# EAGLE schematic Qtouch (EAGLE 5.12)
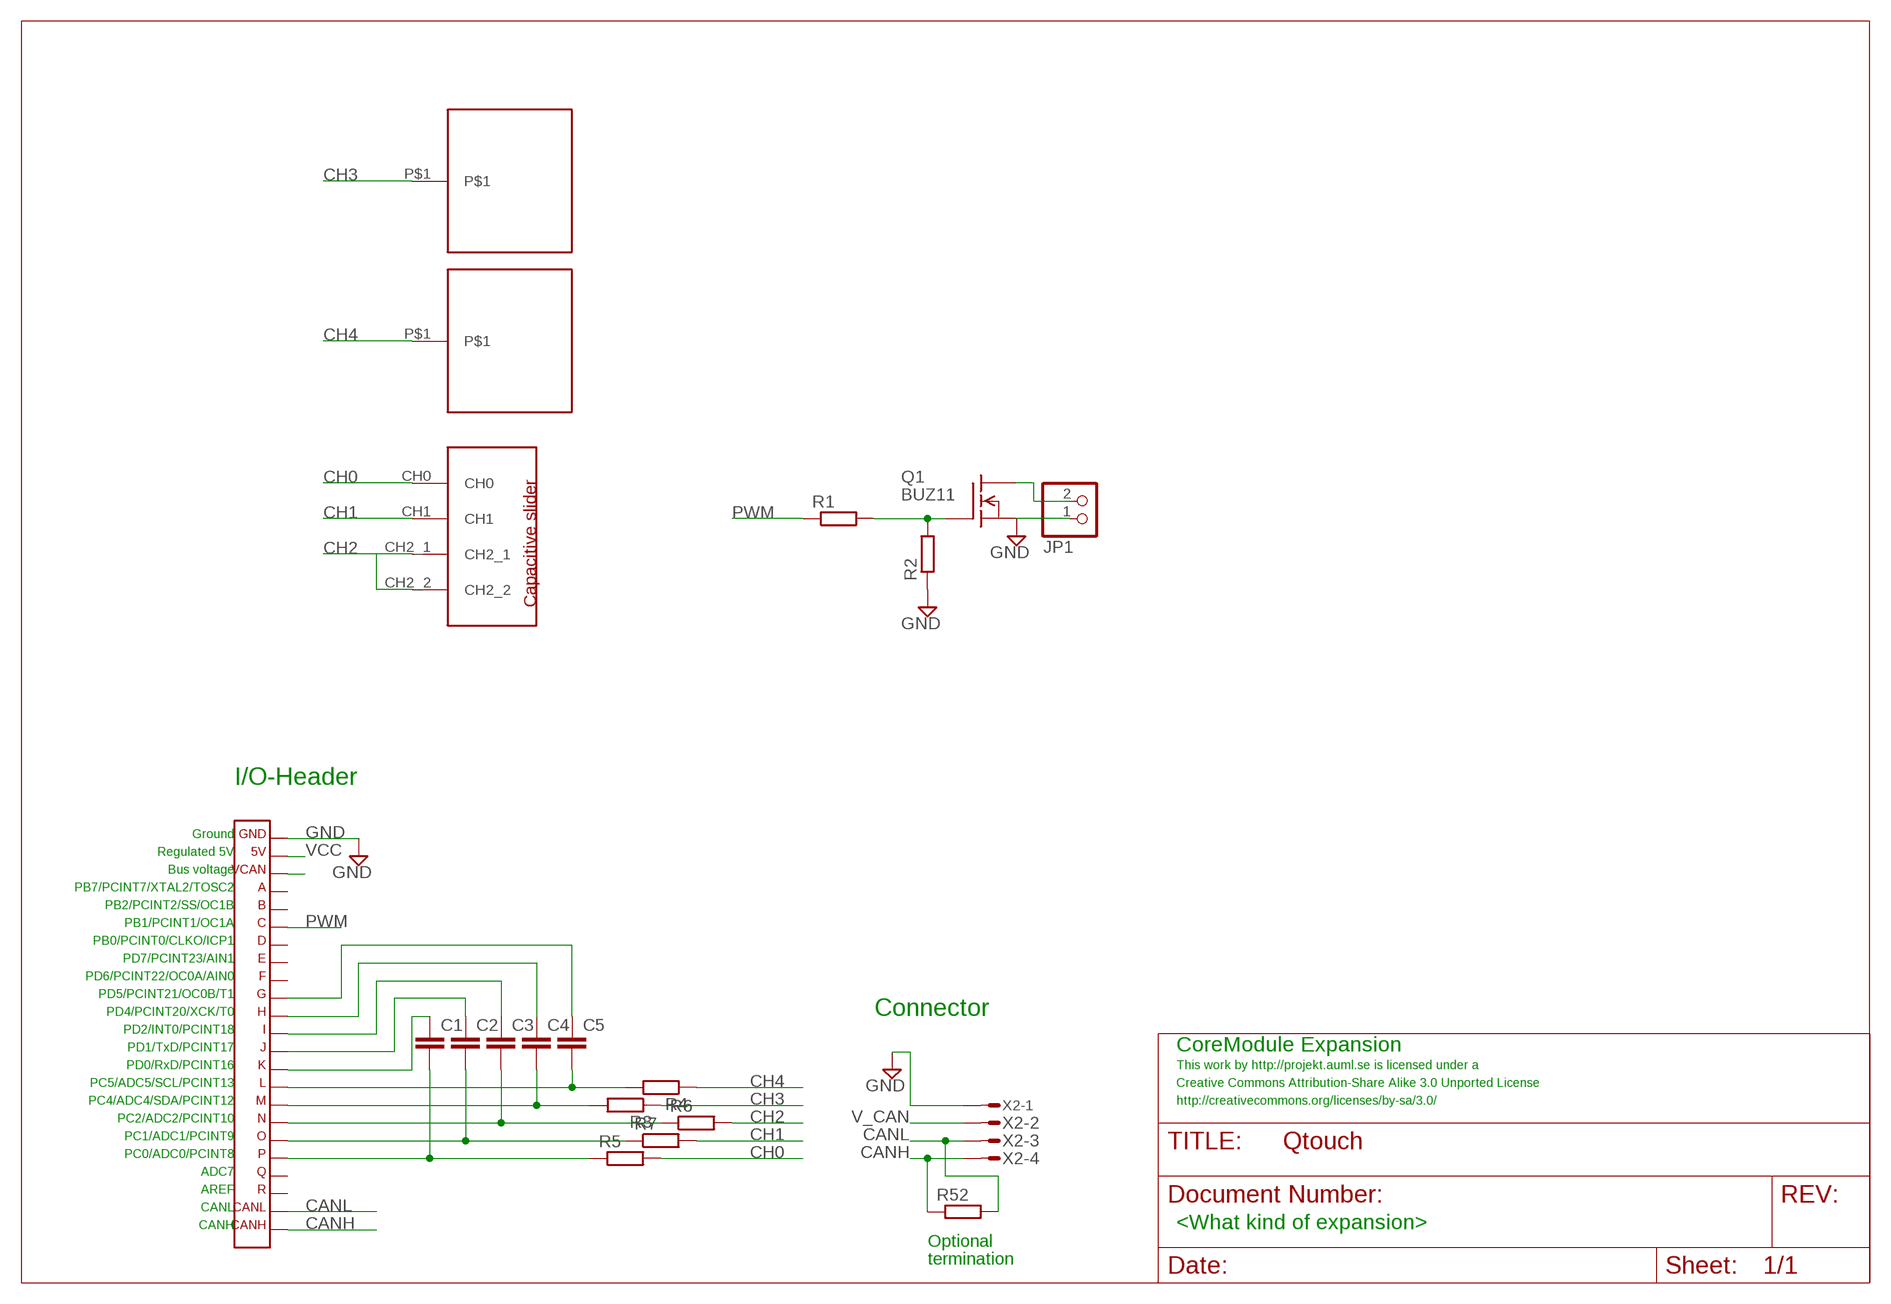
[diagram p0: schematic, sheet 1]

## Parts
C1  C-EUC0603  [C0603]
C2  C-EUC0603  [C0603]
C3  C-EUC0603  [C0603]
C4  C-EUC0603  [C0603]
C5  C-EUC0603  [C0603]
JP1  PINHD-1X2/90  [1X02/90]
Q1  BUZ11  [TO220]
R1  R-EUR0603  [R0603]
R2  R-EUR0603  [R0603]
R3  R-EUR0603  [R0603]
R4  R-EUR0603  [R0603]
R5  R-EUR0603  [R0603]
R6  R-EUR0603  [R0603]
R7  R-EUR0603  [R0603]
R52  R-EUR0603  [R0603]
U$1  SLIDER  [SLIDER_6MM_50MM]
U$2  BUTTON  [BUTTON_12X12MM]
U$3  BUTTON  [BUTTON_12X12MM]
X1  CORETWO_LAYOUTISPHOLES_CU  [CORETWO_LAYOUT_ISPHOLES_CU]
X2  MICROMATCH-4  [MICROMATCH-4]

## Nets
CANH: R52.1 X1.CANH X2.4
CANL: R52.2 X1.CANL X2.3
CH0: R5.2 U$1.CH0
CH1: R7.2 U$1.CH1
CH2: R6.2 U$1.CH2_1 U$1.CH2_2
CH3: R3.1 U$3.P$1
CH4: R4.1 U$2.P$1
EXP_L: C5.2 R4.2 X1.L
EXP_M: C4.2 R3.2 X1.M
EXP_N: C3.2 R6.1 X1.N
EXP_O: C2.2 R7.1 X1.O
EXP_P: C1.2 R5.1 X1.P
GND: JP1.1 Q1.3(S) R2.1 X1.GND X2.1
N$1: Q1.1(G) R1.2 R2.2
N$2: C1.1 X1.K
N$3: C2.1 X1.J
N$4: C3.1 X1.I
N$5: C4.1 X1.H
N$6: C5.1 X1.G
N$7: JP1.2 Q1.2(D)
PWM: R1.1 X1.C
V_CAN: X1.VCAN X2.2
VCC: X1.5V
Unconnected: X1.A X1.B X1.D X1.E X1.F X1.Q X1.R

## Notes on the sheet
- I/O-Header
- Ground
- Regulated 5V
- Bus voltage
- PB7/PCINT7/XTAL2/TOSC2
- PB2/PCINT2/SS/OC1B
- PB1/PCINT1/OC1A
- PB0/PCINT0/CLKO/ICP1
- PD7/PCINT23/AIN1
- PD6/PCINT22/OC0A/AIN0
- PD5/PCINT21/OC0B/T1
- PD4/PCINT20/XCK/T0 | Connector
- PD2/INT0/PCINT18
- PD1/TxD/PCINT17 | CoreModule Expansion
- PD0/RxD/PCINT16 | This work by http://projekt.auml.se is licensed under a
- PC5/ADC5/SCL/PCINT13 | Creative Commons Attribution-Share Alike 3.0 Unported License
- PC4/ADC4/SDA/PCINT12 | http://creativecommons.org/licenses/by-sa/3.0/
- PC2/ADC2/PCINT10
- PC1/ADC1/PCINT9
- PC0/ADC0/PCINT8
- ADC7
- AREF
- CANL
- CANH | <What kind of expansion>
- Optional
- termination

## Library data of the parts
C1-C5 = rcl:C-EU: CAPACITOR, European symbol
JP1 = pinhead:PINHD-1X2: PIN HEADER
Q1 = transistor-fet:BUZ11: N-Channel Enhancement MOSFET 50V; 30A; 0,040Ohm
R1-R7 R52 = rcl:R-EU
U$1 = qtouch:SLIDER
U$2 U$3 = qtouch:BUTTON
X1 = expboard:CORETWO_LAYOUT
X2 = con-amp-micromatch:MICROMATCH-4: MicroMaTch 4 7-215464-4 / 0-215464-4 Drawing Number C-215464 DDEController.pdf; MPN: 7-215464-4; OC_FARNELL: 3784629; OC_NEWARK: 19R8124